# Altium schematic sheet Qunyin_mmWave_flash&USB.SchDoc: mmWave_iwr6843aop
size 457 x 292 mm; DrawnBy: Wxd; Organization: Shanghai Qunyin; Address1: Xianxia Rd 601; Address2: Changning district; Address3: Shanghai; DocumentNumber: 4; SheetNumber: 4; SheetTotal: 6
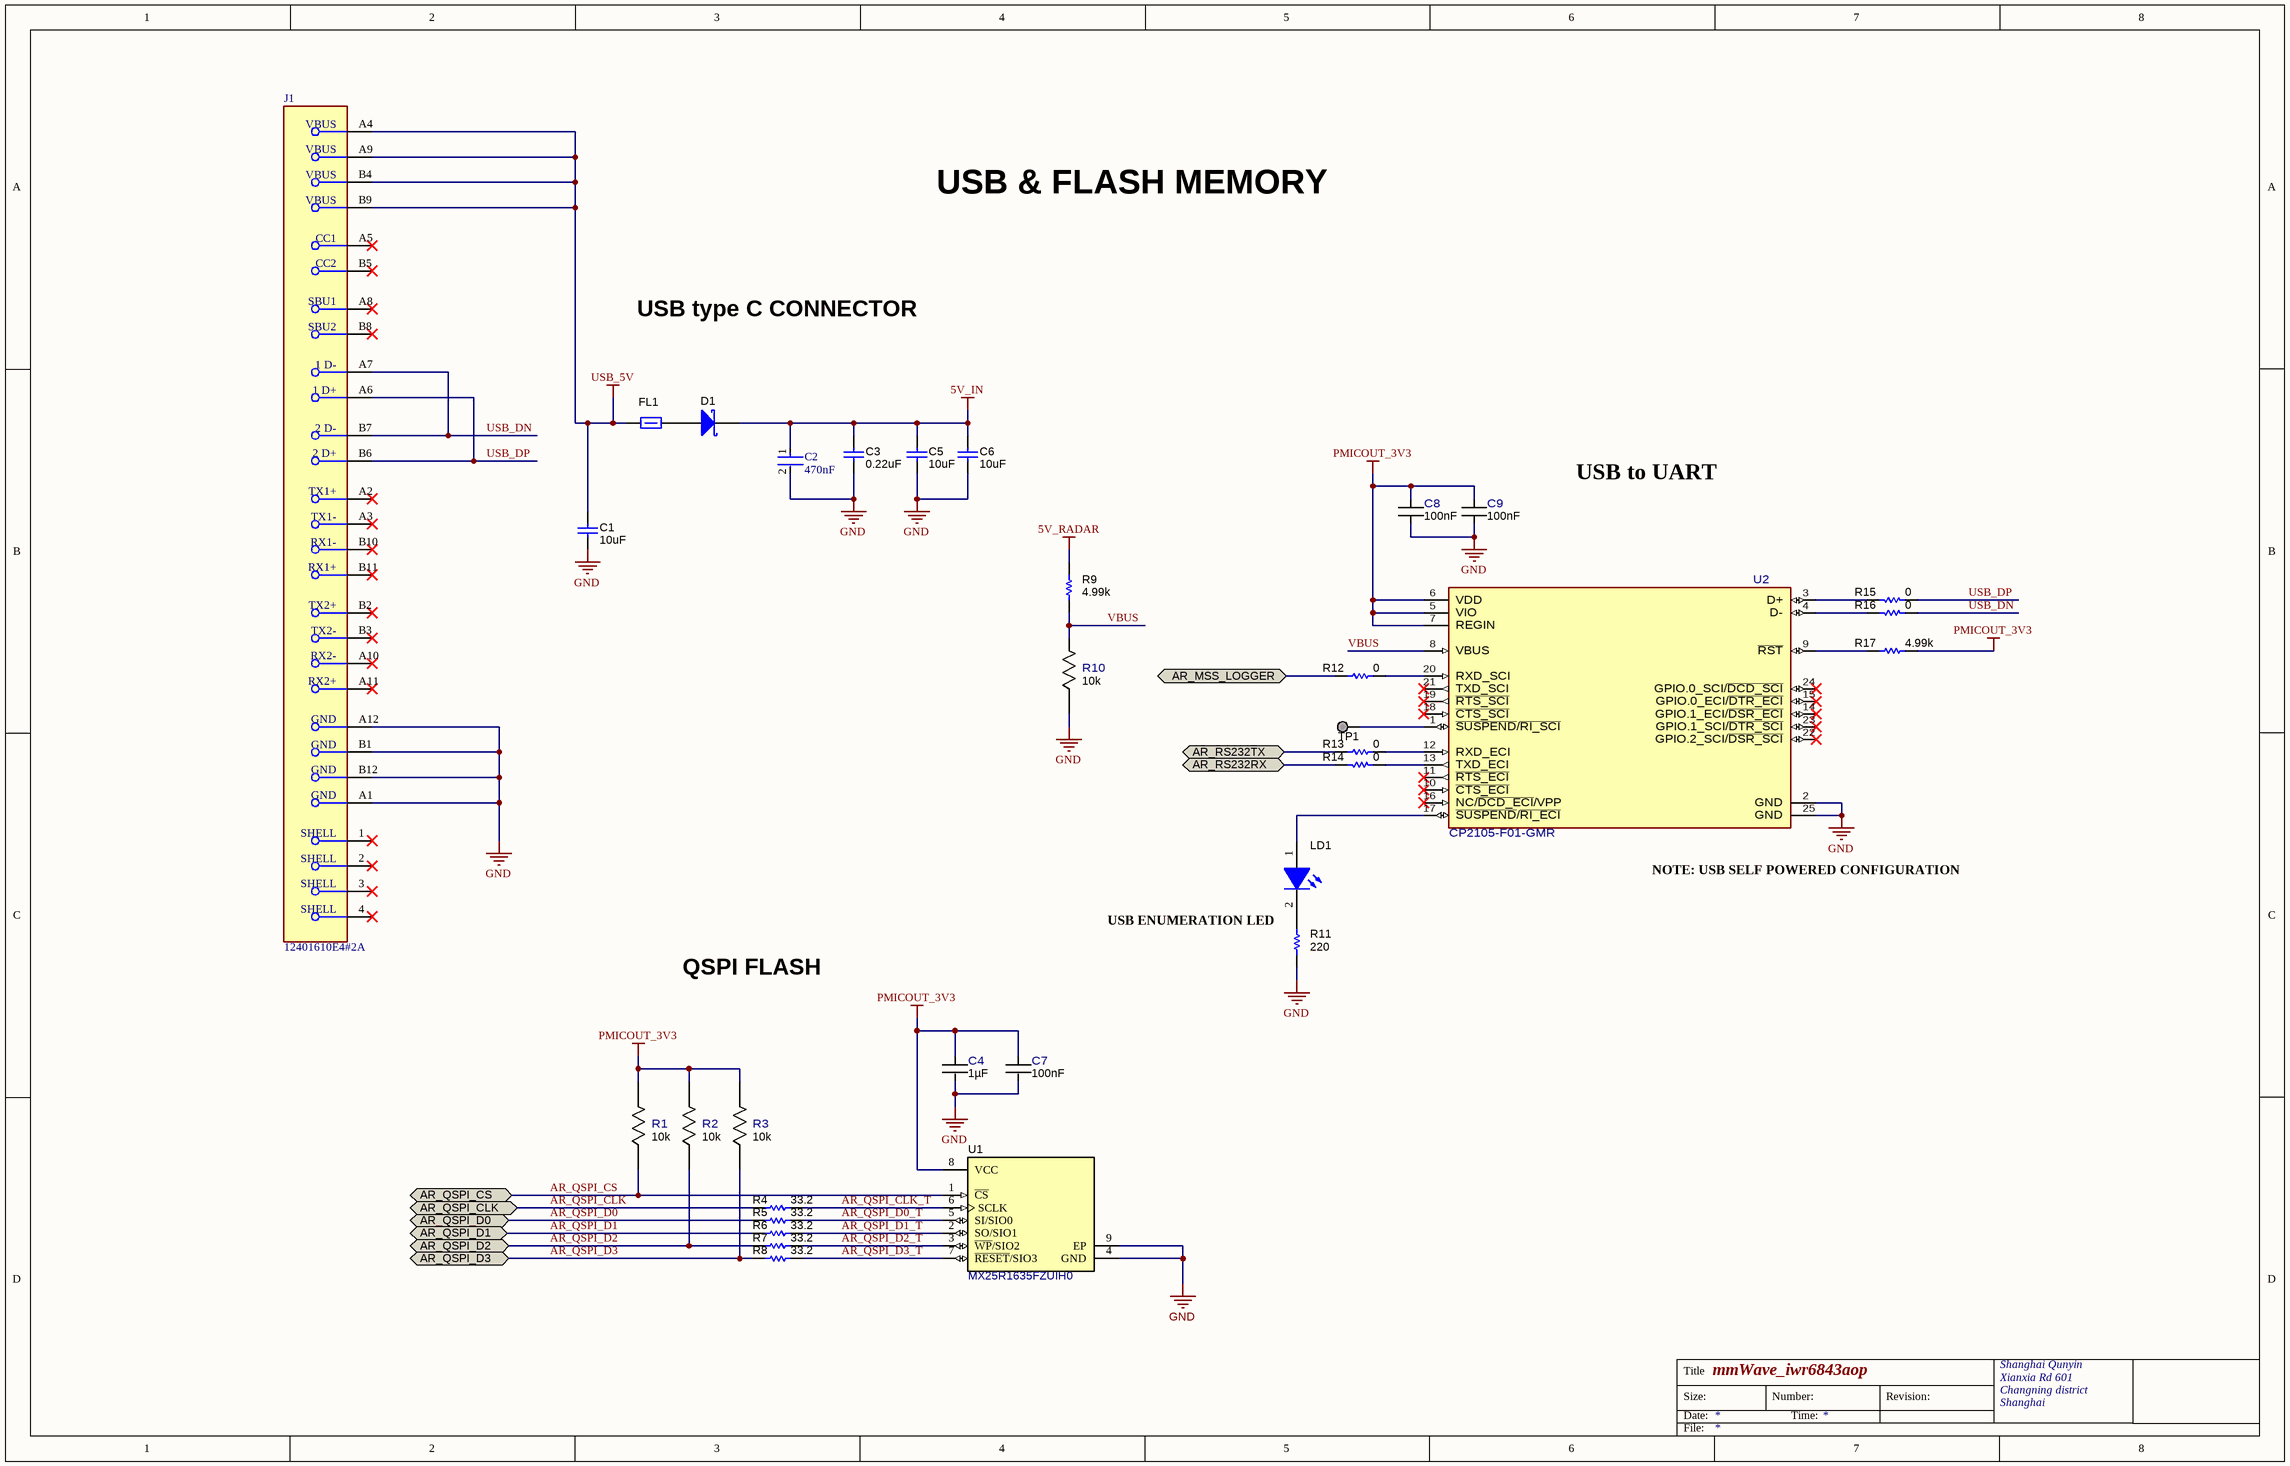
[diagram p0: Qunyin_mmWave_flash&USB.SchDoc]

## Parts
C1  value 10uF  [0402_070]  (hidden comment: CL05A106MP5NUNC)
C2  Capacitance: 470nF  [FP-C1005-050-0_05-IPC_B]  (hidden comment: C1005X5R1E474K050BB)
C3  value 0.22uF  [0201_033L]  (hidden comment: LMK063BJ224MP-F)
C4  Cap_F: 1µF  [FP-CL03A105MO3NRNH_0201-IPC_C]  (hidden comment: CL03A105MO3NRNH)
C5  value 10uF  [0402_070]  (hidden comment: CL05A106MP5NUNC)
C6  value 10uF  [0402_070]  (hidden comment: CL05A106MP5NUNC)
C7  Cap_F: 100nF  [FP-GRM033R6YA104KE14D_0201 (0603 Metric)-IPC_C]  (hidden comment: GRM033R6YA104KE14D)
C8  Cap_F: 100nF  [FP-GRM033R6YA104KE14D_0201 (0603 Metric)-IPC_C]  (hidden comment: GRM033R6YA104KE14D)
C9  Cap_F: 100nF  [FP-GRM033R6YA104KE14D_0201 (0603 Metric)-IPC_C]  (hidden comment: GRM033R6YA104KE14D)
D1  NSR20F30NXT5G  [DSN2_0603]  (value not drawn)
FL1  BLM15PD300SZ1D  [0402L]  (value not drawn)
J1  12401610E4#2A  [FP-12401610E4#2A-MFG]
LD1  APHHS1005CGCK  [APHHS1005_Green]  (value not drawn)
R1  Res_ohm: 10k  [FP-RR0306P-103-D_0201-IPC_C]  (hidden comment: RR0306P-103-D)
R2  Res_ohm: 10k  [FP-RR0306P-103-D_0201-IPC_C]  (hidden comment: RR0306P-103-D)
R3  Res_ohm: 10k  [FP-RR0306P-103-D_0201-IPC_C]  (hidden comment: RR0306P-103-D)
R4  value 33.2  [0201L]  (hidden comment: CRCW020133R2FNED)
R5  value 33.2  [0201L]  (hidden comment: CRCW020133R2FNED)
R6  value 33.2  [0201L]  (hidden comment: CRCW020133R2FNED)
R7  value 33.2  [0201L]  (hidden comment: CRCW020133R2FNED)
R8  value 33.2  [0201L]  (hidden comment: CRCW020133R2FNED)
R9  value 4.99k  [0201L]  (hidden comment: RC0201FR-074K99L)
R10  Res_ohm: 10k  [FP-RR0306P-103-D_0201-IPC_C]  (hidden comment: RR0306P-103-D)
R11  value 220  [0201L]  (hidden comment: RC0201JR-07220RL)
R12  Res_ohm: 0  [FP-RC0201JR-070RL_0201 (0603 Metric)-MFG]  (hidden comment: RC0201JR-070RL)
R13  Res_ohm: 0  [FP-RC0201JR-070RL_0201 (0603 Metric)-MFG]  (hidden comment: RC0201JR-070RL)
R14  Res_ohm: 0  [FP-RC0201JR-070RL_0201 (0603 Metric)-MFG]  (hidden comment: RC0201JR-070RL)
R15  Res_ohm: 0  [FP-RC0201JR-070RL_0201 (0603 Metric)-MFG]  (hidden comment: RC0201JR-070RL)
R16  Res_ohm: 0  [FP-RC0201JR-070RL_0201 (0603 Metric)-MFG]  (hidden comment: RC0201JR-070RL)
R17  value 4.99k  [0201L]  (hidden comment: RC0201FR-074K99L)
TP1  TESTPOINT  [TP_25MIL-SMT]  (value not drawn)  (no BOM)
U1  MX25R1635FZUIH0  [USON-8L]
U2  CP2105-F01-GMR  [FP-CP2105-F01-GMR_QFN24-EP-IPC_A]

## Ports
AR_MSS_LOGGER (bidir), AR_QSPI_CLK (bidir), AR_QSPI_CS (bidir), AR_QSPI_D0 (bidir), AR_QSPI_D1 (bidir), AR_QSPI_D2 (bidir), AR_QSPI_D3 (bidir), AR_RS232RX (bidir), AR_RS232TX (bidir)

## Nets
5V_IN: C2.1 C3.1 C5.2 C6.1 D1.1(K)
5V_RADAR: R9.1
GND: C1.1 C2.2 C3.2 C4.2 C5.1 C6.2 C7.2 C8.1 C9.1 J1.A1(GND) J1.A12(GND) J1.B1(GND) J1.B12(GND) R10.1 R11.1 U1.4(GND) U1.9(EP) U2.2(GND) U2.25(GND)
PMICOUT_3V3: C4.1 C7.1 C8.2 C9.2 R1.2 R2.2 R3.2 R17.1 U1.8(VCC) U2.5(VIO) U2.6(VDD) U2.7(REGIN)
USB_5V: C1.2 FL1.1 J1.A4(VBUS) J1.A9(VBUS) J1.B4(VBUS) J1.B9(VBUS)
AR_MSS_LOGGER: R12.2 ; port AR_MSS_LOGGER
AR_QSPI_CLK: R4.1 ; port AR_QSPI_CLK
AR_QSPI_CLK_T: R4.2 U1.6(SCLK)
AR_QSPI_CS: R1.1 U1.1(~{CS}) ; port AR_QSPI_CS
AR_QSPI_D0: R5.1 ; port AR_QSPI_D0
AR_QSPI_D0_T: R5.2 U1.5(SI/SIO0)
AR_QSPI_D1: R6.1 ; port AR_QSPI_D1
AR_QSPI_D1_T: R6.2 U1.2(SO/SIO1)
AR_QSPI_D2: R2.1 R7.1 ; port AR_QSPI_D2
AR_QSPI_D2_T: R7.2 U1.3(~{WP}/SIO2)
AR_QSPI_D3: R3.1 R8.1 ; port AR_QSPI_D3
AR_QSPI_D3_T: R8.2 U1.7(~{RESET}/SIO3)
AR_RS232RX: R14.1 ; port AR_RS232RX
AR_RS232TX: R13.2 ; port AR_RS232TX
USB_DN: J1.A7(1_D-) J1.B7(2_D-) R16.2
USB_DP: J1.A6(1_D+) J1.B6(2_D+) R15.2
VBUS: R9.2 R10.2 U2.8(VBUS)
NetD1_2: D1.2(A) FL1.2
NetLD1_1: LD1.1(A) U2.17(~{SUSPEND}/~{RI_ECI})
NetLD1_2: LD1.2(K) R11.2
NetR12_1: R12.1 U2.20(RXD_SCI)
NetR13_1: R13.1 U2.12(RXD_ECI)
NetR14_2: R14.2 U2.13(TXD_ECI)
NetR15_1: R15.1 U2.3(D+)
NetR16_1: R16.1 U2.4(D-)
NetR17_2: R17.2 U2.9(~{RST})
NetTP1_1: TP1.1 U2.1(~{SUSPEND}/~{RI_SCI})

Not connected (* = marked no-connect by the designer): J1 1(SHELL)* 2(SHELL)* 3(SHELL)* 4(SHELL)* A2(TX1+)* A3(TX1-)* A5(CC1)* A8(SBU1)* A10(RX2-)* A11(RX2+)* B2(TX2+)* B3(TX2-)* B5(CC2)* B8(SBU2)* B10(RX1-)* B11(RX1+)*; U2 10(~{CTS_ECI})* 11(~{RTS_ECI})* 14(GPIO.1_ECI/~{DSR_ECI})* 15(GPIO.0_ECI/~{DTR_ECI})* 16(NC/~{DCD_ECI}/VPP)* 18(~{CTS_SCI})* 19(~{RTS_SCI})* 21(TXD_SCI)* 22(GPIO.2_SCI/~{DSR_SCI})* 23(GPIO.1_SCI/~{DTR_SCI})* 24(GPIO.0_SCI/~{DCD_SCI})*

## Notes on the sheet
- USB & FLASH MEMORY
- USB type C CONNECTOR
- USB to UART
- (near U2) NOTE: USB SELF POWERED CONFIGURATION
- QSPI FLASH
- USB ENUMERATION LED
- Title
- Size:
- Date:
- Number:
- Time:
- Revision:
- File:

## Library data of the parts
C1 C5 C6 = CMP-0006339-4: CAP, CERM, 10 uF, 10 V, +/- 20%, X5R, 0402; Manufacturer: Samsung Electro-Mechanics; AEC Category: Q200; AEC Qualified: N; Cap_Case: 0402; Cap_F: 10µF; SizeArea_mm2: 0.5; SizeAreaWB_mm2: 3; SizeX_mm: 1; SizeZ_mm: 0.6; TaMax_C: 85°C; TaMin_C: -55°C; U/M: EA; Value1: Unknown; Value2: 10V; RoHS: Y; AEC Grade: N/A; ComponentLink1Description: Datasheet link; ComponentLink1URL: http://www.samsungsem.com/kr/support/product-search/mlcc/__icsFiles/afieldfile/2018/06/21/CL05A106MP5NUNC.pdf; CompType: Capacitor; MountType: SMT; PackageReference: 0402; PartNumber: CL05A106MP5NUNC; Polarized: N; SizeY_mm: 0.5; Technology: Ceramic; TempCo: X5R; Tolerance_%: 20%; ValueDisplayed: 10uF; VDC_V: 10V
C2 = CMP-2000-06003-2: Multilayer Ceramic Capacitors 470nF ±10% 25V X5R SMD 0402; Dissipation Factor: 10%; Case Code (Metric): 1005; RoHS Compliant: Yes; Lead Free: Lead Free; Length: 1mm; Case/Package: 0402; Termination: SMD/SMT; Voltage Rating: 25V; Dielectric Material: Ceramic; Dielectric: X5R; Depth: 0.5mm; Series: C; Voltage: 25V; Tolerance: 10%; Packaging: Tape and Reel; Resistor Type: Ceramic; Min Operating Temperature: -55°C; Width: 0.02inch; Thickness: 500um; Package Quantity: 10000; Case Code (Imperial): 0402; Construction: Flat; Height: 0.5mm; REACH SVHC: No SVHC; Radiation Hardening: No; Weight: 2.3E-05oz; Mount: Surface Mount; Voltage Rating (DC): 25V; Max Operating Temperature: 85°C
C3 = CMP-0009781-1: CAP, CERM, 0.22 uF, 10 V, +/- 20%, X5R, 0201; Manufacturer: Taiyo Yuden; AEC Category: Q200; AEC Qualified: N; Cap_Case: 0201; Cap_F: 220nF; SizeArea_mm2: 0.18; SizeAreaWB_mm2: 2.08; SizeX_mm: 0.6; SizeY_mm: 0.3; SizeZ_mm: 0.33; TaMax_C: 85°C; TaMin_C: -55°C; U/M: EA; Value1: Unknown; Value2: 10V; RoHS: Y; AEC Grade: N/A; ComponentLink1Description: Datasheet link; ComponentLink1URL: http://www.yuden.co.jp/productdata/catalog/en/mlcc_all_e.pdf; CompType: Capacitor; LatestRevisionDate: 2017-03-09; MountType: SMT; PackageReference: 0201; PartNumber: LMK063BJ224MP-F; Polarized: N; Published: 2008-06-19; Publisher: Texas Instruments; Supplier 1: Digi-Key; Supplier 2: Newark; Supplier 3: Mouser; Supplier Part Number 1: 587-2483-1-ND; Supplier Part Number 2: 48T3327; Supplier Part Number 3: 963-LMK063BJ224MP-F; Technology: Ceramic; TempCo: X5R; Tolerance_%: 20%; ValueDisplayed: 0.22uF; VDC_V: 10V
C4 = CMP-0086446-1: 1µF ±20% 16V Ceramic Capacitor X5R 0201; Manufacturer: Samsung Electro-Mechanics; AEC Qualified: No; SizeZ_mm: 0.39mm; Symbol Name: SYM-CL03A105MO3NRNH; TempCo: 15%; RoHS: TRUE; ComponentLink1Description: Datasheet; ComponentLink1URL: http://www.samsungsem.com/global/front/downloadcms.do?path=%2F%2Fglobal%2F%2Fsupport%2F%2Fproduct-search%2F%2Fmlcc%2F%2F__icsFiles%2F%2Fafieldfile%2F%2F2018%2F%2F06%2F%2F21&fileName=CL03A105MO3NRNH.pdf; PackageReference: 0201; PartNumber: CL03A105MO3NRNH; Tolerance_%: 20%; VDC_V: 16V
C7-C9 = CMP-0086440-1: Cap Ceramic 0.1uF 35V X5R 10% Pad SMD 0201 85C T/R; Manufacturer: Murata Electronics North America; AEC Qualified: No; SizeZ_mm: 0.33mm; Symbol Name: SYM-GRM033R6YA104KE14D; TempCo: 15%; RoHS: TRUE; ComponentLink1Description: Datasheet; ComponentLink1URL: https://search.murata.co.jp/Ceramy/image/img/A01X/G101/ENG/GRM033R6YA104KE14-01.pdf; PackageReference: 0201 (0603 Metric); PartNumber: GRM033R6YA104KE14D; Tolerance_%: 10%; VDC_V: 35V
D1 = CMP-0028829-2: Diode, Schottky, 30 V, 2 A, 2-XFDFN; Manufacturer: ON Semiconductor; Value2: 0.48V; SizeY_mm: 0.8; Value: 30V; TJmax_C: 150°C; Green_Lifecycle: Not Set; SizeAreaWB_mm2: 4.68; Value1: 2A; SizeArea_mm2: 1.28; Green_REACh: Incomplete; AEC Category: Q101; SizeZ_mm: 0.31; Vf_V: 480mV; AEC Qualified: N; SizeX_mm: 1.6; Green_EU RoHS: Incomplete; PackageReference: 2-XFDFN; RoHS: Y; PartNumber: NSR20F30NXT5G; ComponentLink1Description: Datasheet link; Vr_V: 30V; MountType: SMT; Type: Schottky; CompType: Diode; Green_EU RoHS-2: Incomplete; ComponentLink1URL: http://www.onsemi.com/pub_link/Collateral/NSR20F30-D.PDF; Io_A: 2A
FL1 = CMP-0078934-1: Inductor, Ferrite Bead, Ferrite, 2.2 A, 0.035 ohm, AEC-Q200 Grade 1, SMD; Manufacturer: MuRata; AEC Category: Q200; AEC Grade: 1; AEC Qualified: Y; DCR_ohm: 0.035; Imax_A: 2.2A; SizeArea_mm2: 0.5; SizeAreaWB_mm2: 3; SizeZ_mm: 0.6; RoHS: Y; ComponentLink1Description: Datasheet link; ComponentLink1URL: https://www.murata.com/en-us/products/productdata/8796748677150/QNFA9118.pdf; CompType: Inductor; LatestRevisionDate: 2017-12-07; Material: Ferrite; MountType: SMT; PackageReference: 0402; PartNumber: BLM15PD300SZ1D; Published: 2008-06-26; Publisher: Texas Instruments; SizeX_mm: 1; SizeY_mm: 0.5; Supplier 1: Digi-Key; Supplier 2: Mouser; Supplier Part Number 1: 490-16506-1-ND; Supplier Part Number 2: 81-BLM15PD300SZ1D; Technology: Ferrite Bead; Value1: 0.035 ohm; Value2: 2.2A
J1 = CMP-02355-000003-1: CONN RCP USB3.1 TYPEC 24P SMD RA; Connector Type: USB; Number of Contacts: 24; Gender: Receptacle; Packaging: Cut Tape; Mount: Surface Mount; Number of Pins: 24
LD1 = CMP-0067682-2: LED, Green, SMD; Manufacturer: Kingbright; Angle: 120.0; Power_TotalModule: 75mW; SizeZ_mm: 0.6; Vf_V: 2.1V; Vr_V: 5V; Io_A: 20mA; Ir_A: 10µA; SizeArea_mm2: 0.5; SizeAreaWB_mm2: 3.0; SizeX_mm: 1.0; Tjmax_C: 85°C; Value1: 0.075W; RoHS: Y; Color: Green; ComponentLink1Description: Datasheet link; ComponentLink1URL: http://www.kingbrightusa.com/images/catalog/SPEC/APHHS1005CGCK.pdf; PackageReference: 0402; PartNumber: APHHS1005CGCK; CompType: LED; MountType: SMT; SizeY_mm: 0.5; Type: ?; Value2: 2.1V; Value: Green
R1-R3 R10 = CMP-0088002-1: 10 kOhms ±0.5% 0.05W, 1/20W Chip Resistor 0201 (0603 Metric)  Thin Film; Manufacturer: Susumu; AEC Qualified: No; Power_W: 50mW; SizeZ_mm: 0.26mm; Symbol Name: SYM-RR0306P-103-D; TempCo: 25ppm/°C; VDC_V: 15V; RoHS: TRUE; ComponentLink1Description: Datasheet; ComponentLink1URL: https://www.susumu.co.jp/common/pdf/n_catalog_partition05_en.pdf; PackageReference: 0201; PartNumber: RR0306P-103-D; Technology: Thin Film; Tolerance_%: 0.5%
R4-R8 = CMP-0027275-3: RES, 33.2, 1%, 0.05 W, 0201; Manufacturer: Vishay-Dale; AEC Category: Q200; AEC Qualified: N; EIA_Code: E96; Power_W: 50mW; SizeArea_mm2: 0.18; SizeX_mm: 0.6; SizeY_mm: 0.3; SizeZ_mm: 0.26; TempCo: 200 ppm/C; Value2: 0.05W; Value_Code: 33R2; RoHS: E; AEC Grade: N/A; ComponentLink1Description: Datasheet link; ComponentLink1URL: http://www.vishay.com/docs/20052/crcw0201e3.pdf; CompType: Resistor; MountType: SMT; PackageReference: 0201; PartNumber: CRCW020133R2FNED; Res_ohm: 33.2; Supplier 1: Digi-Key; Supplier 2: Newark; Supplier 3: Mouser; Supplier Part Number 1: 541-33.2ABCT-ND; Supplier Part Number 2: 26W8649; Supplier Part Number 3: 71-CRCW020133R2FNED; Technology: Thick Film; Tolerance_%: 1%; Value1: 1%; ValueDisplayed: 33.2
R9 R17 = CMP-0027745-1: RES, 4.99 k, 1%, 0.05 W, 0201; Manufacturer: Yageo America; AEC Category: Q200; AEC Qualified: N; EIA_Code: E96; Power_W: 50mW; SizeArea_mm2: 0.18; SizeX_mm: 0.6; SizeY_mm: 0.3; SizeZ_mm: 0.26; TempCo: 200 ppm/C; U/M: EA; Value2: 0.05W; Value_Code: 4k99; VDC_V: 25V; RoHS: Y; AEC Grade: N/A; ComponentLink1Description: Datasheet link; ComponentLink1URL: http://www.yageo.com/documents/recent/PYu-RC_Group_51_RoHS_L_5.pdf; CompType: Resistor; LatestRevisionDate: 2017-03-09; MountType: SMT; PackageReference: 0201; PartNumber: RC0201FR-074K99L; Published: 2016-10-14; Publisher: Texas Instruments; Res_ohm: 4.99k; Supplier 1: Digi-Key; Supplier 2: Mouser; Supplier Part Number 1: YAG2712CT-ND; Supplier Part Number 2: 603-RC0201FR-074K99L; Technology: Thick Film; Tolerance_%: 1%; Value1: 1%; ValueDisplayed: 4.99k
R11 = CMP-0027072-1: RES, 220, 5%, 0.05 W, 0201; Manufacturer: Yageo America; AEC Category: Q200; AEC Qualified: N; EIA_Code: E24; Power_W: 50mW; SizeArea_mm2: 0.18; SizeX_mm: 0.6; SizeY_mm: 0.3; SizeZ_mm: 0.26; TempCo: 200 ppm/C; U/M: EA; Value2: 0.05W; Value_Code: 220R; VDC_V: 25V; RoHS: Y; AEC Grade: N/A; ComponentLink1Description: Datasheet link; ComponentLink1URL: http://www.yageo.com/documents/recent/PYu-RC_Group_51_RoHS_L_5.pdf; CompType: Resistor; LatestRevisionDate: 2017-03-09; MountType: SMT; PackageReference: 0201; PartNumber: RC0201JR-07220RL; Published: 2016-10-14; Publisher: Texas Instruments; Res_ohm: 220; Supplier 1: Digi-Key; Supplier 2: Mouser; Supplier Part Number 1: 311-220NCT-ND; Supplier Part Number 2: 603-RC0201JR-07220RL; Technology: Thick Film; Tolerance_%: 5%; Value1: 5%; ValueDisplayed: 220
R12-R16 = CMP-0086442-2: RES SMD 0 OHM JUMPER 1/20W 0201; Manufacturer: Yageo; AEC Qualified: No; Power_W: 50mW; SizeZ_mm: 0.26mm; TempCo: 200ppm/°C; Tolerance_%: 5%; VDC_V: 25V; RoHS: TRUE; ComponentLink1Description: Datasheet; ComponentLink1URL: http://www.yageo.com/documents/recent/PYu-RC_Group_51_RoHS_L_10.pdf; PackageReference: 0201 (0603 Metric); PartNumber: RC0201JR-070RL; Technology: Thick Film
TP1 = CMP-0078143-3: TEST POINT.  No entry in BOM.; CompType: Testpoint; Manufacturer: N/A; PackageReference: N/A; PartNumber: N/A; Library Reference: TESTPOINT
U1 = CMP-0078466-1: ULTRA LOW POWER, 16M-BIT [x 1/x 2/x 4] CMOS MXSMIO (SERIAL MULTI I/O) FLASH MEMORY, SON-8; Manufacturer: Macronix International Co., LTD; SizeArea_mm2: 6; SizeAreaWB_mm2: 12; SizeX_mm: 3; SizeY_mm: 2; SizeZ_mm: 0.6; RoHS: Y; ComponentLink1Description: Datasheet URL; ComponentLink1URL: http://www.macronix.com/Lists/Datasheet/Attachments/6257/MX25R1635F,%20Wide%20Range,%2016Mb,%20v1.5.pdf; MountType: SMT; PackageReference: SON-8; PartNumber: MX25R1635FZUIH0; Supplier 1: Digi-Key; Supplier Part Number 1: 1092-1178-1-ND
U2 = CMP-0087172-1: I/O Controller Interface IC USB to Dual UART bridge; Manufacturer: Silicon Labs; SizeZ_mm: 0.8mm; RoHS: TRUE; ComponentLink1Description: Datasheet; ComponentLink1URL: https://www.silabs.com/documents/public/data-sheets/CP2105.pdf; PackageReference: QFN24-EP; PartNumber: CP2105-F01-GMR; Symbol Name: SYM-CP2105-F01-GMR